# Altium schematic sheet 03_MCU.SchDoc
size A4
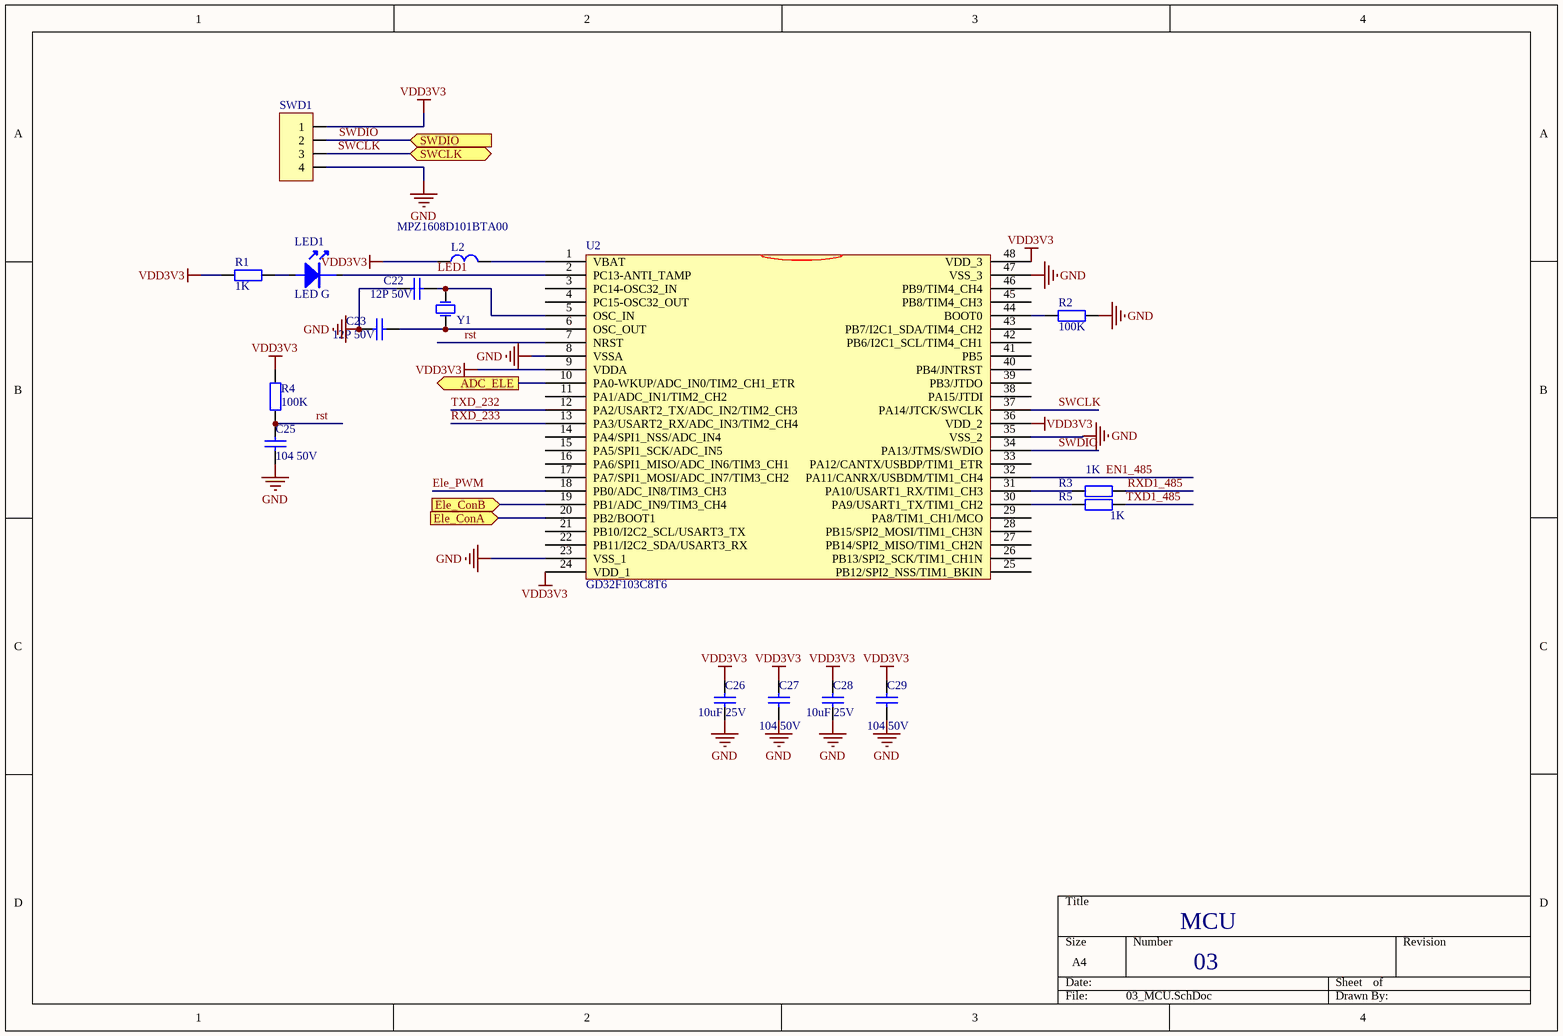
[diagram p0: 03_MCU.SchDoc]

## Parts
C22  12P 50V  [SMD-0603C]
C23  12P 50V  [SMD-0603C]
C25  104 50V  [SMD-0603C]
C26  10uF 25V  [SMD-0805C]
C27  104 50V  [SMD-0603C]
C28  10uF 25V  [SMD-0805C]
C29  104 50V  [SMD-0603C]
L2  MPZ1608D101BTA00  [SMD-0603]
LED1  LED G  [SMD-0603D]
R1  1K  [SMD-0603]
R2  100K  [SMD-0603]
R3  1K  [SMD-0603]
R4  100K  [SMD-0603]
R5  1K  [SMD-0603]
SWD1  SIP-4 (NC)  [SIP-4]  (value not drawn)
U2  GD32F103C8T6  [LQFP48]
Y1  8MHz  [XTAL-3225-2]  (value not drawn)

## Ports
ADC_ELE (out), Ele_ConA (in), Ele_ConB (in), SWCLK (bidir), SWDIO (in)

## Nets
GND: C22.2 C23.2 C25.1 C26.1 C27.1 C28.1 C29.1 R2.2 SWD1.4 U2.8(VSSA) U2.23(VSS_1) U2.35(VSS_2) U2.47(VSS_3)
VDD3V3: C26.2 C27.2 C28.2 C29.2 L2.2 R1.2 R4.1 SWD1.1 U2.9(VDDA) U2.24(VDD_1) U2.36(VDD_2) U2.48(VDD_3)
ADC_ELE: U2.10(PA0-WKUP/ADC_IN0/TIM2_CH1_ETR) ; port ADC_ELE
Ele_ConA: U2.20(PB2/BOOT1) ; port Ele_ConA
Ele_ConB: U2.19(PB1/ADC_IN9/TIM3_CH4) ; port Ele_ConB
Ele_PWM: U2.18(PB0/ADC_IN8/TIM3_CH3)
EN1_485: U2.32(PA11/CANRX/USBDM/TIM1_CH4)
LED1: LED1.2(K) U2.2(PC13-ANTI_TAMP)
rst: C25.2 R4.2 U2.7(NRST)
RXD1_485: R3.2
RXD_233: U2.13(PA3/USART2_RX/ADC_IN3/TIM2_CH4)
SWCLK: SWD1.3 U2.37(PA14/JTCK/SWCLK) ; port SWCLK
SWDIO: SWD1.2 U2.34(PA13/JTMS/SWDIO) ; port SWDIO
TXD1_485: R5.2
TXD_232: U2.12(PA2/USART2_TX/ADC_IN2/TIM2_CH3)
NetC22_1: C22.1 U2.5(OSC_IN) Y1.1(OSC1)
NetC23_1: C23.1 U2.6(OSC_OUT) Y1.2(OSC2)
NetL2_1: L2.1 U2.1(VBAT)
NetLED1_1: LED1.1(A) R1.1
NetR2_1: R2.1 U2.44(BOOT0)
NetR3_1: R3.1 U2.31(PA10/USART1_RX/TIM1_CH3)
NetR5_1: R5.1 U2.30(PA9/USART1_TX/TIM1_CH2)

Not connected (* = marked no-connect by the designer): U2 3(PC14-OSC32_IN) 4(PC15-OSC32_OUT) 11(PA1/ADC_IN1/TIM2_CH2) 14(PA4/SPI1_NSS/ADC_IN4) 15(PA5/SPI1_SCK/ADC_IN5) 16(PA6/SPI1_MISO/ADC_IN6/TIM3_CH1) 17(PA7/SPI1_MOSI/ADC_IN7/TIM3_CH2) 21(PB10/I2C2_SCL/USART3_TX) 22(PB11/I2C2_SDA/USART3_RX) 25(PB12/SPI2_NSS/TIM1_BKIN) 26(PB13/SPI2_SCK/TIM1_CH1N) 27(PB14/SPI2_MISO/TIM1_CH2N) 28(PB15/SPI2_MOSI/TIM1_CH3N) 29(PA8/TIM1_CH1/MCO) 33(PA12/CANTX/USBDP/TIM1_ETR) 38(PA15/JTDI) 39(PB3/JTDO) 40(PB4/JNTRST) 41(PB5) 42(PB6/I2C1_SCL/TIM4_CH1) 43(PB7/I2C1_SDA/TIM4_CH2) 45(PB8/TIM4_CH3) 46(PB9/TIM4_CH4)

## Notes on the sheet
- MCU
- 03

## Library data of the parts
C22 C23 = CAP4: 贴片电容 5%
C25-C29 = CAP4: 贴片电容 20%
L2 = CIZHU1: 磁珠电感 100R 100MHz
LED1 = LED: 绿色普亮
R1 = RES0: 贴片电阻 5%
R2-R5 = RES2: 贴片电阻 5%
SWD1 = SIP-4: ISP 下载
U2 = STM32F103C6
Y1 = XTAL: 3225 贴片晶振